# EAGLE design poiduino7(7) (EAGLE 7.7.0)
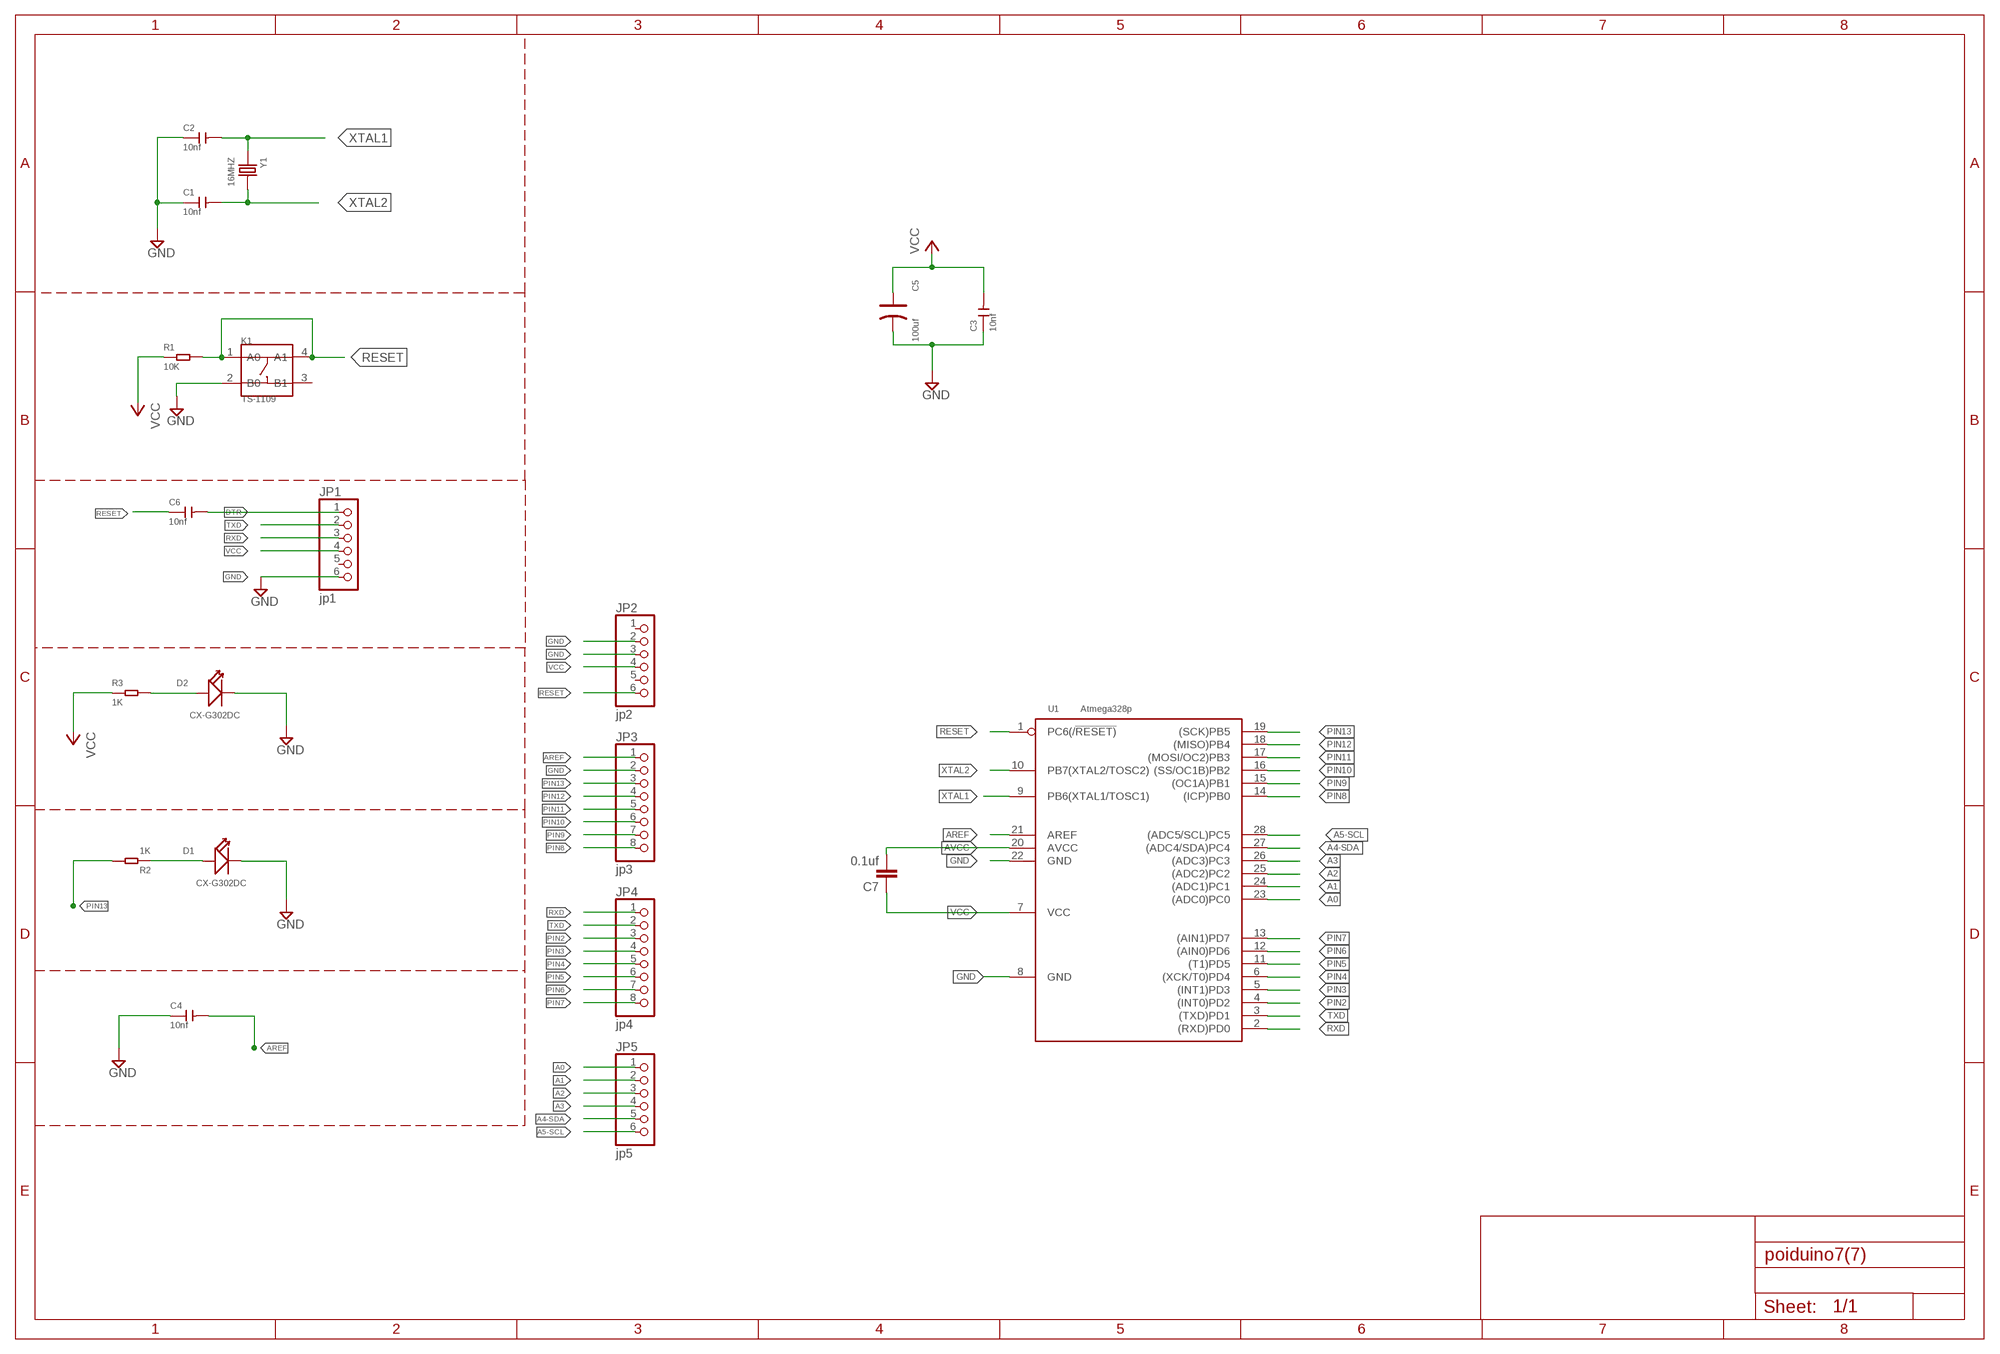
[diagram p0: schematic, sheet 1]

## Parts
C1  10nf  DIP-CERAMIC-DISC-10NF-50V-Y5V(D4.0MM)  [CERAMIC-2.54]
C2  10nf  DIP-CERAMIC-DISC-10NF-50V-Y5V(D4.0MM)  [CERAMIC-2.54]
C3  10nf  DIP-CERAMIC-DISC-10NF-50V-Y5V(D4.0MM)  [CERAMIC-2.54]
C4  10nf  DIP-CERAMIC-DISC-10NF-50V-Y5V(D4.0MM)  [CERAMIC-2.54]
C5  100uf  DIP-ALUMINUM-47UF-16V(D5-H7MM)  [PC-D5.3MM]
C6  10nf  DIP-CERAMIC-DISC-10NF-50V-Y5V(D4.0MM)  [CERAMIC-2.54]
C7  0.1uf  C5/2.5  [C5B2.5]
D1  CX-G302DC  DIP-LED-GREEN-GREEN(2P-D3MM)  [LED2-2.54-D3.0MM]
D2  CX-G302DC  DIP-LED-GREEN-GREEN(2P-D3MM)  [LED2-2.54-D3.0MM]
JP1  jp1  PINHD-1X6  [1X06]
JP2  jp2  PINHD-1X6  [1X06]
JP3  jp3  PINHD-1X8  [1X08]
JP4  jp4  PINHD-1X8  [1X08]
JP5  jp5  PINHD-1X6  [1X06]
K1  TS-1109  DIP-BUTTON-4P  [SW4-6.0X6.0X5.0MM]
R1  10K  DIP-RES-10K-5%-1/4W(PR-D2.3XL6.5MM)  [PR-D2.3XL6.5MM]
R2  1K  DIP-RES-1K-5%-1/4W(PR-D2.3XL6.5MM)  [PR-D2.3XL6.5MM]
R3  1K  DIP-RES-1K-5%-1/4W(PR-D2.3XL6.5MM)  [PR-D2.3XL6.5MM]
U1  Atmega328p  MCU-ATMEGA328P-PU(DIP28)  [DIP28-2.54-34.7X7.62MM]
Y1  16MHZ  DIP-CRYSTAL-16MHZ-18PF-30PPM-40R(HC49US)  [HC49US]

## Nets
A0: JP5.1 U1.23((ADC0)PC0)
A1: JP5.2 U1.24((ADC1)PC1)
A2: JP5.3 U1.25((ADC2)PC2)
A3: JP5.4 U1.26((ADC3)PC3)
A4-SDA: JP5.5 U1.27((ADC4/SDA)PC4)
A5-SCL: JP5.6 U1.28((ADC5/SCL)PC5)
AREF: C4.2 JP3.1 U1.21(AREF)
AVCC: C7.2 U1.20(AVCC)
DTR: C6.2 JP1.1
GND: C1.1 C2.1 C3.1 C4.1 C5.- D1.K(-) D2.K(-) JP1.6 JP2.2 JP2.3 JP3.2 K1.2(B0) U1.8(GND) U1.22(GND)
N$3: D2.A(+) R3.2
N$6: D1.A(+) R2.1
PIN2: JP4.3 U1.4((INT0)PD2)
PIN3: JP4.4 U1.5((INT1)PD3)
PIN4: JP4.5 U1.6((XCK/T0)PD4)
PIN5: JP4.6 U1.11((T1)PD5)
PIN6: JP4.7 U1.12((AIN0)PD6)
PIN7: JP4.8 U1.13((AIN1)PD7)
PIN8: JP3.8 U1.14((ICP)PB0)
PIN9: JP3.7 U1.15((OC1A)PB1)
PIN10: JP3.6 U1.16((SS/OC1B)PB2)
PIN11: JP3.5 U1.17((MOSI/OC2)PB3)
PIN12: JP3.4 U1.18((MISO)PB4)
PIN13: JP3.3 R2.2 U1.19((SCK)PB5)
RESET: C6.1 JP2.6 K1.1(A0) K1.4(A1) R1.2 U1.1(PC6(/!RESET))
RXD: JP1.3 JP4.1 U1.2((RXD)PD0)
TXD: JP1.2 JP4.2 U1.3((TXD)PD1)
VCC: C3.2 C5.+ C7.1 JP1.4 JP2.4 R1.1 R3.1 U1.7(VCC)
XTAL1: C2.2 U1.9(PB6(XTAL1/TOSC1)) Y1.1
XTAL2: C1.2 U1.10(PB7(XTAL2/TOSC2)) Y1.2
Unconnected: JP1.5 JP2.1 JP2.5 K1.3(B1)

## Library data of the parts
C1-C4 C6 = Seeed-Capacitor:DIP-CERAMIC-DISC-10NF-50V-Y5V(D4.0MM): 302010202
C5 = Seeed-Capacitor:DIP-ALUMINUM-47UF-16V(D5-H7MM): 302030033; MPN: KS 100uF/16V
C7 = capacitor-wima:C: CAPACITOR naming: grid - package width
D1 D2 = Seeed-LED:DIP-LED-GREEN-GREEN(2P-D3MM): 304090040; MPN: CX-G302DC
JP1 JP2 JP5 = pinhead:PINHD-1X6: PIN HEADER
JP3 JP4 = pinhead:PINHD-1X8: PIN HEADER
K1 = Seeed-OPL-Button:DIP-BUTTON-4P: 311020024; MPN: TS-1109
R1 = Seeed-Resistor:DIP-RES-10K-5%-1/4W(PR-D2.3XL6.5MM): 301020001; MPN: FHCFR-1/4W-103J
R2 R3 = Seeed-Resistor:DIP-RES-1K-5%-1/4W(PR-D2.3XL6.5MM): 301020000; MPN: FHCFR-1/4W-102J
U1 = Seeed-IC:MCU-ATMEGA328P-PU(DIP28): 310010051; MPN: ATMEGA328P-PU
Y1 = Seeed-Crystal Oscillator:DIP-CRYSTAL-16MHZ-18PF-30PPM-40R(HC49US): 306010014; MPN: HC-49US 16.000MHz

## Board
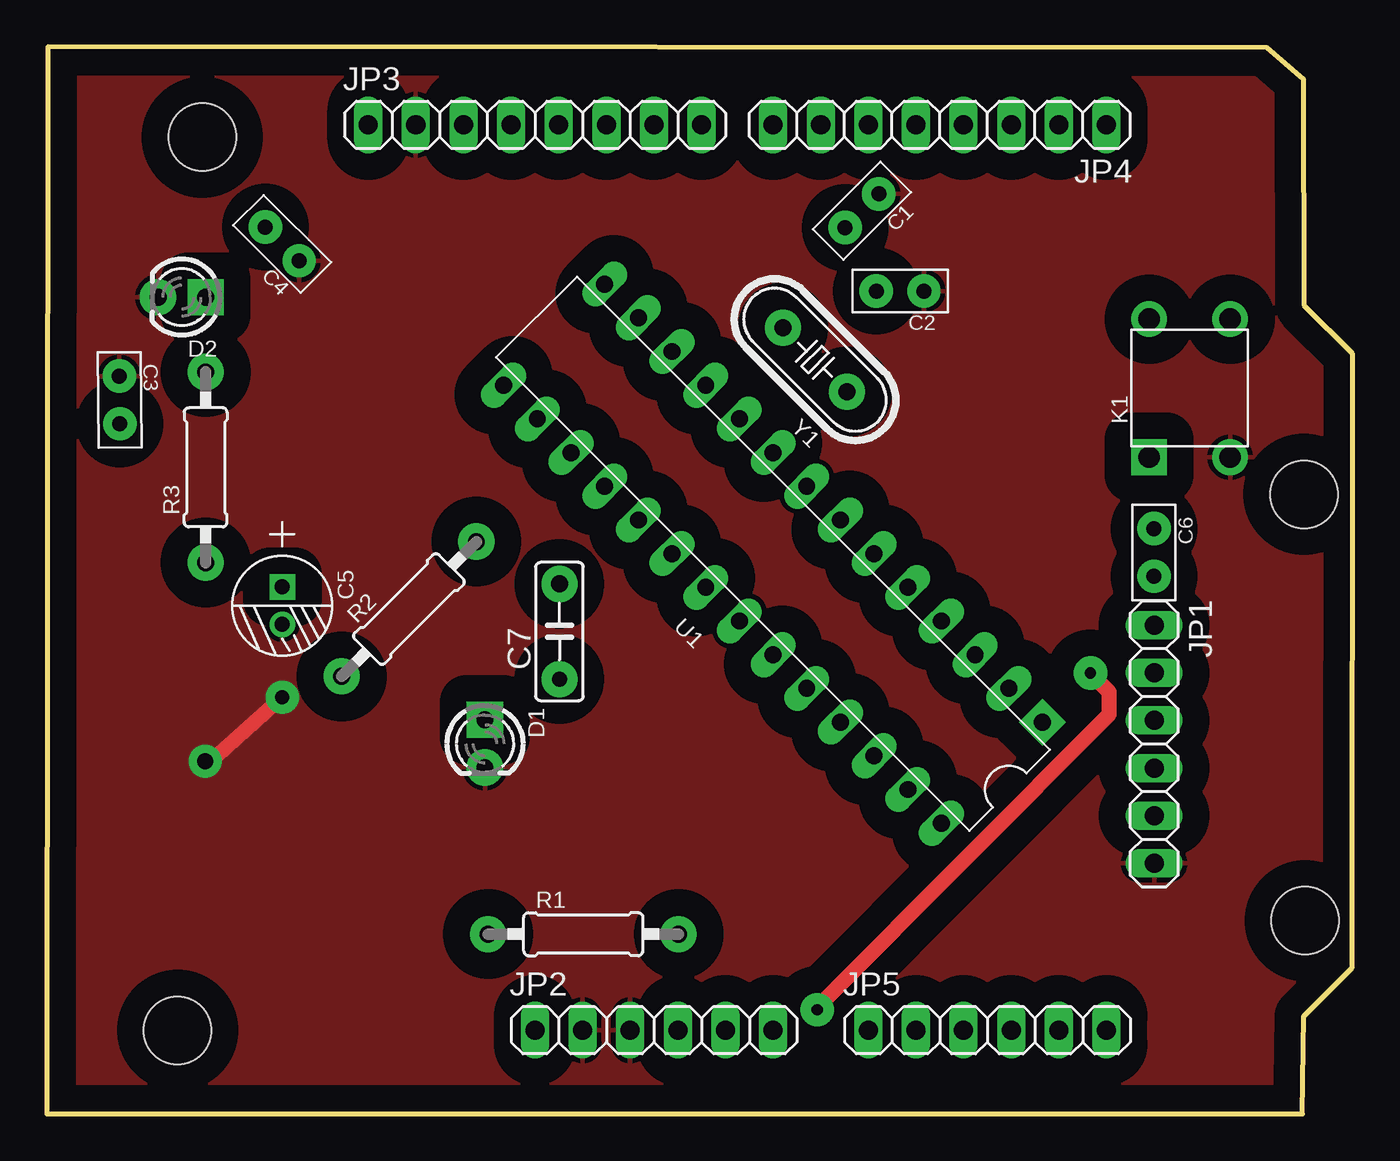
[diagram p1: board, top side]
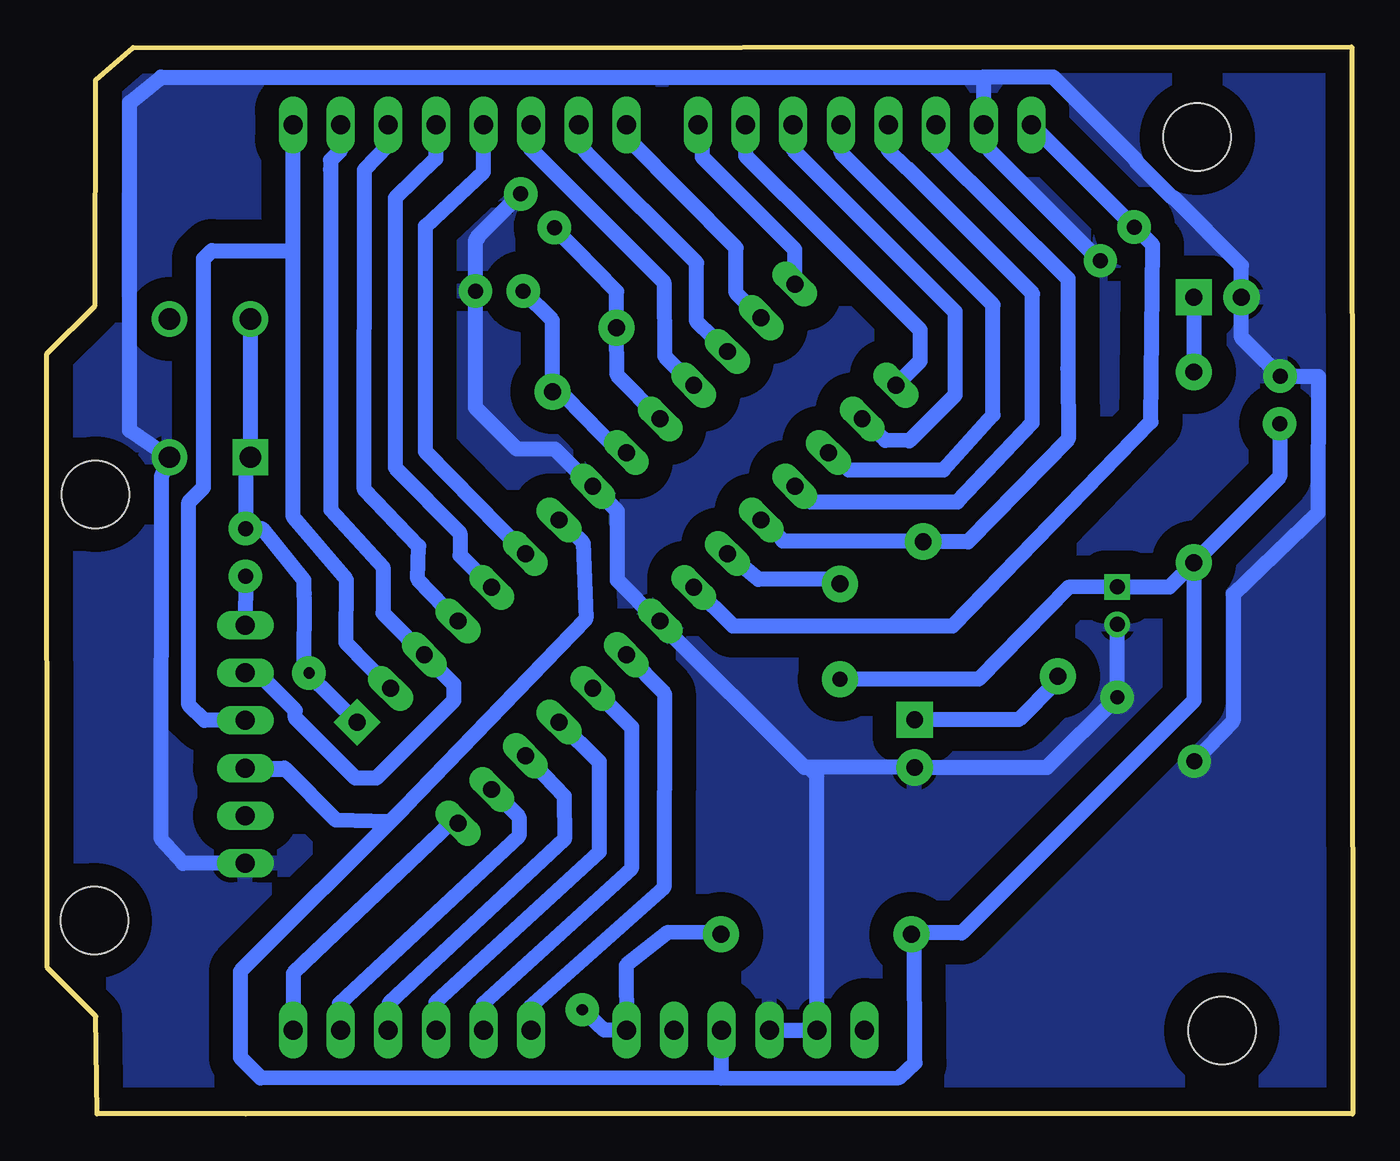
[diagram p2: board, bottom side, seen from below]

Size 69.63 x 56.88 mm. Coordinates in mm from the lower left corner, seen from the top.
Outline: 0,0.01 59.03,0.01 66.95,0 67.02,5.21 69.61,7.8 69.63,40.51 67.06,43.08 67.02,55.14 65.05,56.84 0.05,56.88 0,0.01
Copper layers (1*16): Top 0.035mm / dielectric 1.5mm / Bottom 0.035mm
Design rules "fabmodule": minimum track width 10mil, minimum drill 0.4mm, track to track 0.42mm, track to pad 0.42mm, pad to pad 0.42mm, via to via 0.42mm, smd to smd 0.42mm, copper to edge 40mil, drill to drill 0.8mm, minimum pad ring 10mil, minimum via ring 8mil, stop-mask expansion 4mil, vias tented up to drill 0mil, thermal gap 10mil
Holes 3.6 mm at 8.29,52.07 6.97,4.45 67.1,10.3 67.03,33.03

### Footprints (pad centres in the part's own frame; a part is rotated, then mirrored left to right if it is on the bottom)
CERAMIC-2.54 = drill 0.8 pad 1.778: 1 -1.27,0; 2 1.27,0
PC-D5.3MM = drill 0.8 pad 1.35 square: + -1,0 | drill 0.8 pad 1.35: - 1,0
C5B2.5 = drill 0.813 pad 1.93: 1 -2.54,0 | drill 0.9 pad 1.93: 2 2.54,0
LED2-2.54-D3.0MM = drill 0.9 pad 1.93 square: A -1.27,0 | drill 0.9 pad 1.93: K 1.27,0
1X06 = drill 1.016 long: 1 -6.35,0; 2 -3.81,0; 3 -1.27,0; 4 1.27,0; 5 3.81,0; 6 6.35,0
1X08 = drill 1.016 long: 1 -8.89,0; 2 -6.35,0; 3 -3.81,0; 4 -1.27,0; 5 1.27,0; 6 3.81,0; 7 6.35,0; 8 8.89,0
SW4-6.0X6.0X5.0MM = drill 1.143 pad 1.905 square: 1 -3.683,2.159 | drill 1.143 pad 1.905: 2 -3.683,-2.159; 3 3.683,-2.159; 4 3.683,2.159
PR-D2.3XL6.5MM = drill 0.9 pad 1.93: 1 -4.953,0; 2 5.207,0
DIP28-2.54-34.7X7.62MM = drill 0.9 pad 1.778 square: 1 -16.51,-3.81 | drill 0.9 pad 1.4 long: 2 -13.97,-3.81; 3 -11.43,-3.81; 4 -8.89,-3.81; 5 -6.35,-3.81; 6 -3.81,-3.81; 7 -1.27,-3.81; 8 1.27,-3.81; 9 3.81,-3.81; 10 6.35,-3.81; 11 8.89,-3.81; 12 11.43,-3.81; 13 13.97,-3.81; 14 16.51,-3.81; 15 16.51,3.81; 16 13.97,3.81; 17 11.43,3.81; 18 8.89,3.81; 19 6.35,3.81; 20 3.81,3.81; 21 1.27,3.81; 22 -1.27,3.81; 23 -3.81,3.81; 24 -6.35,3.81; 25 -8.89,3.81; 26 -11.43,3.81; 27 -13.97,3.81; 28 -16.51,3.81
HC49US = drill 0.9 pad 1.93: 1 -2.413,0; 2 2.413,0

### Placement (x,y rotation side)
C1  43.47,48.14 225 top
C2  45.5,43.87 180 top
C3  3.88,38.06 270.6 top
C4  12.55,46.38 135 top
C5  12.55,27.09 270 top
C6  59.04,29.93 270 top
C7  27.33,25.71 90 top
D1  23.36,19.74 270 top
D2  7.2,43.54 180 top
JP1  59.05,19.71 270 top
JP2  32.38,4.47 0 top
JP3  26.03,52.73 0 top
JP4  47.62,52.73 180 top
JP5  50.16,4.47 0 top
K1  60.94,38.69 90 top
R1  28.48,9.58 0 top
R2  19.22,26.83 45 top
R3  8.47,34.34 90 top
U1  38.73,29.87 135 top
Y1  40.96,40.21 135 top

### Tracks (layer width: path | path; a pad name or v marks a point on that pad's centre or on a via)
A0
  Bottom 0.813: U1.23 36.71,22.42 36.73,12.07 43.91,5.65 43.89,4.55 JP5.1
A1
  Bottom 0.813: U1.24 38.44,20.62 38.47,13.07 46.36,5.88 46.34,4.92 46.31,4.74 46.39,4.51 JP5.2
A2
  Bottom 0.813: U1.25 40.18,18.78 40.18,13.96 48.89,5.95 48.93,4.52 JP5.3
A3
  Bottom 0.813: U1.26 42.04,16.94 42.04,14.64 51.38,5.9 51.33,4.56 JP5.4
A4-SDA
  Bottom 0.813: U1.27 44.46,15.84 44.46,14.81 54.03,5.89 54.03,4.53 JP5.5
A5-SCL
  Bottom 0.813: U1.28 48.09,15.5 56.49,7.49 56.49,4.48 JP5.6
AREF
  Bottom 0.813: U1.21 33.05,26.02 21.33,26.02 10.75,36.89 10.66,46.31 C4.2 17.11,52.73 JP3.1
AVCC
  Bottom 0.813: C7.2 28.07,28.51 31.69,28.5 U1.20
DTR
  Bottom 0.813: C6.2 JP1.1
GND  (via drill 0.75 pad 1.78, 0.85 pad 1.78)
  Top 0.813: v12.55,22.21 8.68,18.74 8.6,18.75 v8.44,18.8
  Bottom 0.813: 19.67,55.27 19.68,54 JP3.2 19.37,52.42 19.37,51.38 13.47,45.48 C4.1 | JP2.3 JP2.2 28.58,4.48 28.58,18.05 28.99,18.47 | JP1.6 62.37,13.36 63.53,14.64 63.51,33.99 K1.2 65.22,36.44 65.22,53.92 63.54,55.27 19.67,55.27 | 37.04,26.27 U1.22 36.93,26.11 | 37.04,26.27 39.2,28.44 39.2,32.14 U1.8 40.63,33.46 40.63,33.53 42.54,35.44 44.56,35.44 46.78,37.65 46.78,43.9 | C5.- v12.55,22.21 16.29,18.47 D1.K 28.99,18.47 | 19.67,55.27 15.97,55.27 11.51,50.81 11.51,50.73 9.62,48.84 9.54,48.84 5.93,45.23 D2.K 5.93,41.4 C3.1 1.82,39.32 1.85,32.05 6.37,27.71 6.37,20.97 v8.44,18.8 | 28.99,18.47 29.23,18.47 37.04,26.27 | C1.1 46.74,46.67 | 46.78,43.9 46.78,46.54 46.66,46.67 | C2.1 46.77,43.89 46.78,43.9
  pour Bottom (isolate 1.27): -0.78,58.59 70.78,58.59 70.78,-2.57 -0.94,-2.57 -0.94,58.59
  pour Top (isolate 1.422): -2.1,58.71 70.88,58.73 71.52,-2.74 -1.96,-2.94 -2.15,57.85
N$3
  Bottom 0.813: D2.A R3.2
N$6
  Bottom 0.813: R2.1 15.87,22.96 17.8,21.02 23.34,21.02 D1.A
PIN2
  Bottom 0.813: U1.4 49.86,28.51 49.81,30.27 52.71,33.29 52.69,50.33 51.43,51.63 JP4.3
PIN3
  Bottom 0.813: JP4.4 48.89,52.76 48.89,50.91 51.05,48.82 51.06,34.45 47.61,30.96 47.61,29.78 U1.5
PIN4
  Bottom 0.813: U1.6 49.44,35.31 49.44,47.33 46.35,50.22 JP4.5
PIN5
  Bottom 0.813: JP4.6 43.82,51.41 36.73,44.35 36.69,40.4 U1.11
PIN6
  Bottom 0.813: U1.12 34.98,42.23 34.98,45.37 40.76,51.12 41.02,51.42 41.36,52.26 41.18,52.64 JP4.7
PIN7
  Bottom 0.813: U1.13 32.87,43.76 32.87,46.16 38.58,51.92 38.61,52.61 JP4.8
PIN8
  Bottom 0.813: U1.14 29.75,46.08 34.68,51.01 34.68,52.49 JP3.8
PIN9
  Bottom 0.813: JP3.7 32.38,51.07 30.33,49.02 30.3,49.02 23.07,41.8 23.07,40.13 U1.15
PIN10
  Bottom 0.813: JP3.6 29.84,51.4 21.21,42.77 21.21,38.32 23.64,35.88 24.92,35.91 U1.16
PIN11
  Bottom 0.813: U1.17 27.73,35.11 26.88,34.33 21.81,34.33 19.17,37.27 19.17,43.13 27.28,51.24 27.28,52.71 JP3.5
PIN12
  Bottom 0.813: JP3.4 24.76,51.38 23.83,50.45 23.8,50.45 17.09,43.75 | 17.09,43.75 17.05,43.71 | U1.18 29.62,33.46 28.9,32.62 21.07,32.62 17.09,36.83 17.09,43.75
PIN13
  Bottom 0.813: U1.19 31.39,31.66 30.38,30.55 23.5,30.55 R2.2 20.5,30.5 15.17,35.98 15.19,39.72 15.18,44.52 22.22,51.51 JP3.3
RESET  (via drill 0.6 pad 1.78)
  Top 0.813: v41.08,5.55 41.47,6.05 56.66,21.3 56.66,22.48 v55.65,23.5
  Bottom 0.813: U1.1 55.7,23.43 | 55.7,23.43 55.9,24.08 55.9,27.39 55.9,27.74 55.92,28.46 58.13,31.19 C6.1 59.04,34.75 K1.1 K1.4 | R1.2 34.06,9.66 36.52,9.68 38.74,7.92 JP2.6 39.92,4.47 v41.08,5.55 | v55.65,23.5 55.7,23.53 55.7,23.43
RXD
  Bottom 0.813: U1.2 53.68,25.12 53.66,28.47 56.49,31.81 56.51,41.15 56.51,46.15 | 56.51,46.15 JP4.1 | JP1.3 61.24,20.98 62.06,21.8 62.06,32.62 61.27,33.4 61.27,45.59 60.84,46.02 56.63,46.02 56.51,46.15
TXD
  Bottom 0.813: JP4.2 53.95,51.4 54.51,50.84 54.51,50.34 54.5,32.2 51.71,29.15 51.71,26.7 51.43,26.43 U1.3 47.93,22.91 47.93,22.03 52.07,17.9 53.17,17.9 56.39,21.11 56.39,21.51 58.39,23.52 JP1.2
VCC
  Bottom 0.813: JP2.4 33.67,1.91 | 33.67,1.91 24.19,1.94 23.33,2.72 23.36,9.3 R1.1 23.45,9.66 20.84,9.66 8.47,22.03 R3.1 | U1.7 42.28,31.66 41.04,30.47 40.88,26.38 51.33,15.57 | 51.33,15.57 54.21,15.66 56.86,18.34 | 56.86,18.34 59.42,18.34 59.56,18.19 | JP1.4 56.96,18.44 56.86,18.34 | 51.33,15.57 50.62,16.3 59.32,7.6 59.32,3.01 58.23,1.93 33.67,1.91 | C7.1 25.33,23.18 19.96,23.18 15.16,28.07 C5.+ 9.76,28.09 R3.1 | C3.2 3.89,33.97 R3.1
XTAL1
  Bottom 0.813: U1.9 39.1,35.29 41.96,38.23 43.13,38.25 Y1.1 42.67,42.31 C2.2
XTAL2
  Bottom 0.813: U1.10 39.22,39.38 Y1.2 39.25,43.85 C1.2